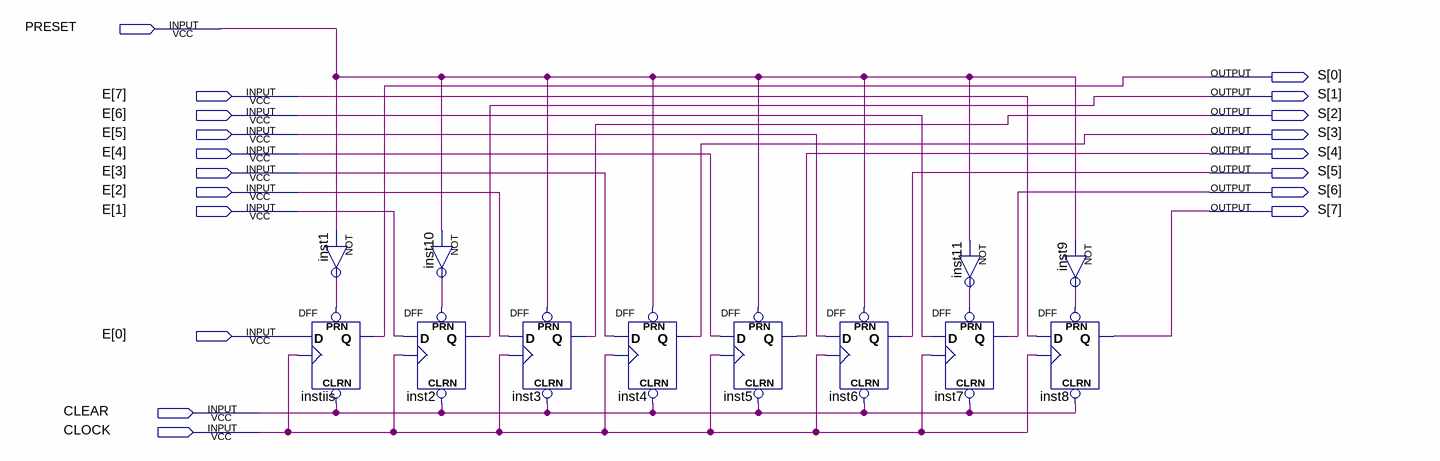
[diagram p0: schematic sheet]
// Quartus schematic linha_3.bdf as structural Verilog: 12 symbols, 19 pins
module linha_3 (
  input  PRESET,
  input  [7:0] E,
  input  CLEAR,
  input  CLOCK,
  output [7:0] S
);

  wire inst1_out, inst9_out, inst10_out, inst11_out;

  not inst1 (inst1_out, PRESET);
  DFF instiis (.CLRN(CLEAR), .CLK(CLOCK), .D(E[0]), .PRN(inst1_out), .Q(S[0]));
  not inst10 (inst10_out, PRESET);
  DFF inst2 (.CLRN(CLEAR), .CLK(CLOCK), .D(E[1]), .PRN(inst10_out), .Q(S[1]));
  DFF inst3 (.CLRN(CLEAR), .CLK(CLOCK), .D(E[2]), .PRN(PRESET), .Q(S[2]));
  DFF inst4 (.CLRN(CLEAR), .CLK(CLOCK), .D(E[3]), .PRN(PRESET), .Q(S[3]));
  DFF inst5 (.CLRN(CLEAR), .CLK(CLOCK), .D(E[4]), .PRN(PRESET), .Q(S[4]));
  DFF inst6 (.CLRN(CLEAR), .CLK(CLOCK), .D(E[5]), .PRN(PRESET), .Q(S[5]));
  not inst11 (inst11_out, PRESET);
  DFF inst7 (.CLRN(CLEAR), .CLK(CLOCK), .D(E[6]), .PRN(inst11_out), .Q(S[6]));
  not inst9 (inst9_out, PRESET);
  DFF inst8 (.CLRN(CLEAR), .CLK(CLOCK), .D(E[7]), .PRN(inst9_out), .Q(S[7]));
endmodule
